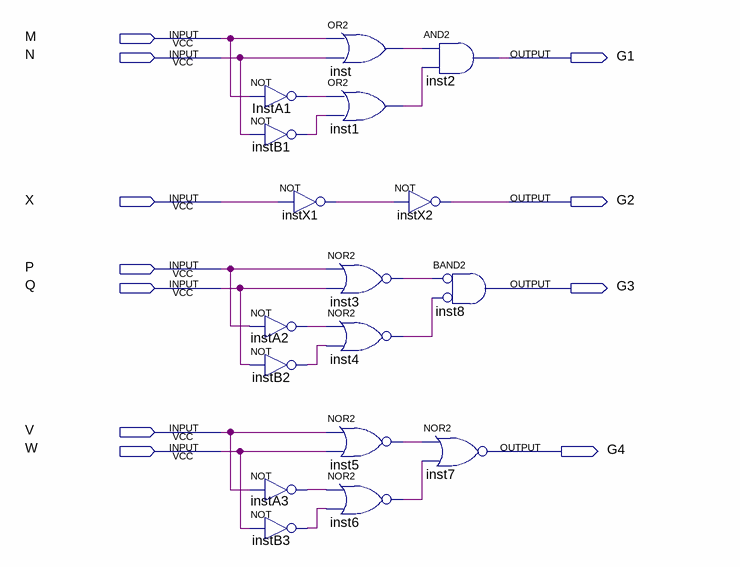
[diagram p0: schematic sheet]
// Quartus schematic P0Bubble.bdf as structural Verilog: 17 symbols, 11 pins
module P0Bubble (
  input  M,
  input  N,
  input  X,
  input  P,
  input  Q,
  input  V,
  input  W,
  output G1,
  output G2,
  output G3,
  output G4
);

  wire inst1_out, inst3_out, inst4_out, inst5_out, inst6_out, inst_out, InstA1_out, instA2_out, instA3_out,
       instB1_out, instB2_out, instB3_out, instX1_out;

  not InstA1 (InstA1_out, M);
  not instB1 (instB1_out, N);
  not instA2 (instA2_out, P);
  not instB2 (instB2_out, Q);
  not instA3 (instA3_out, V);
  not instB3 (instB3_out, W);
  or inst (inst_out, M, N);
  or inst1 (inst1_out, InstA1_out, instB1_out);
  not instX1 (instX1_out, X);
  nor inst3 (inst3_out, P, Q);
  nor inst4 (inst4_out, instA2_out, instB2_out);
  nor inst5 (inst5_out, V, W);
  nor inst6 (inst6_out, instA3_out, instB3_out);
  and inst2 (G1, inst_out, inst1_out);
  not instX2 (G2, instX1_out);
  nor inst7 (G4, inst5_out, inst6_out);
  and inst8 (G3, ~inst3_out, ~inst4_out);  // BAND2
endmodule
